# EasyEDA Pro project 主板&9V稳压.epro, board 主板V2
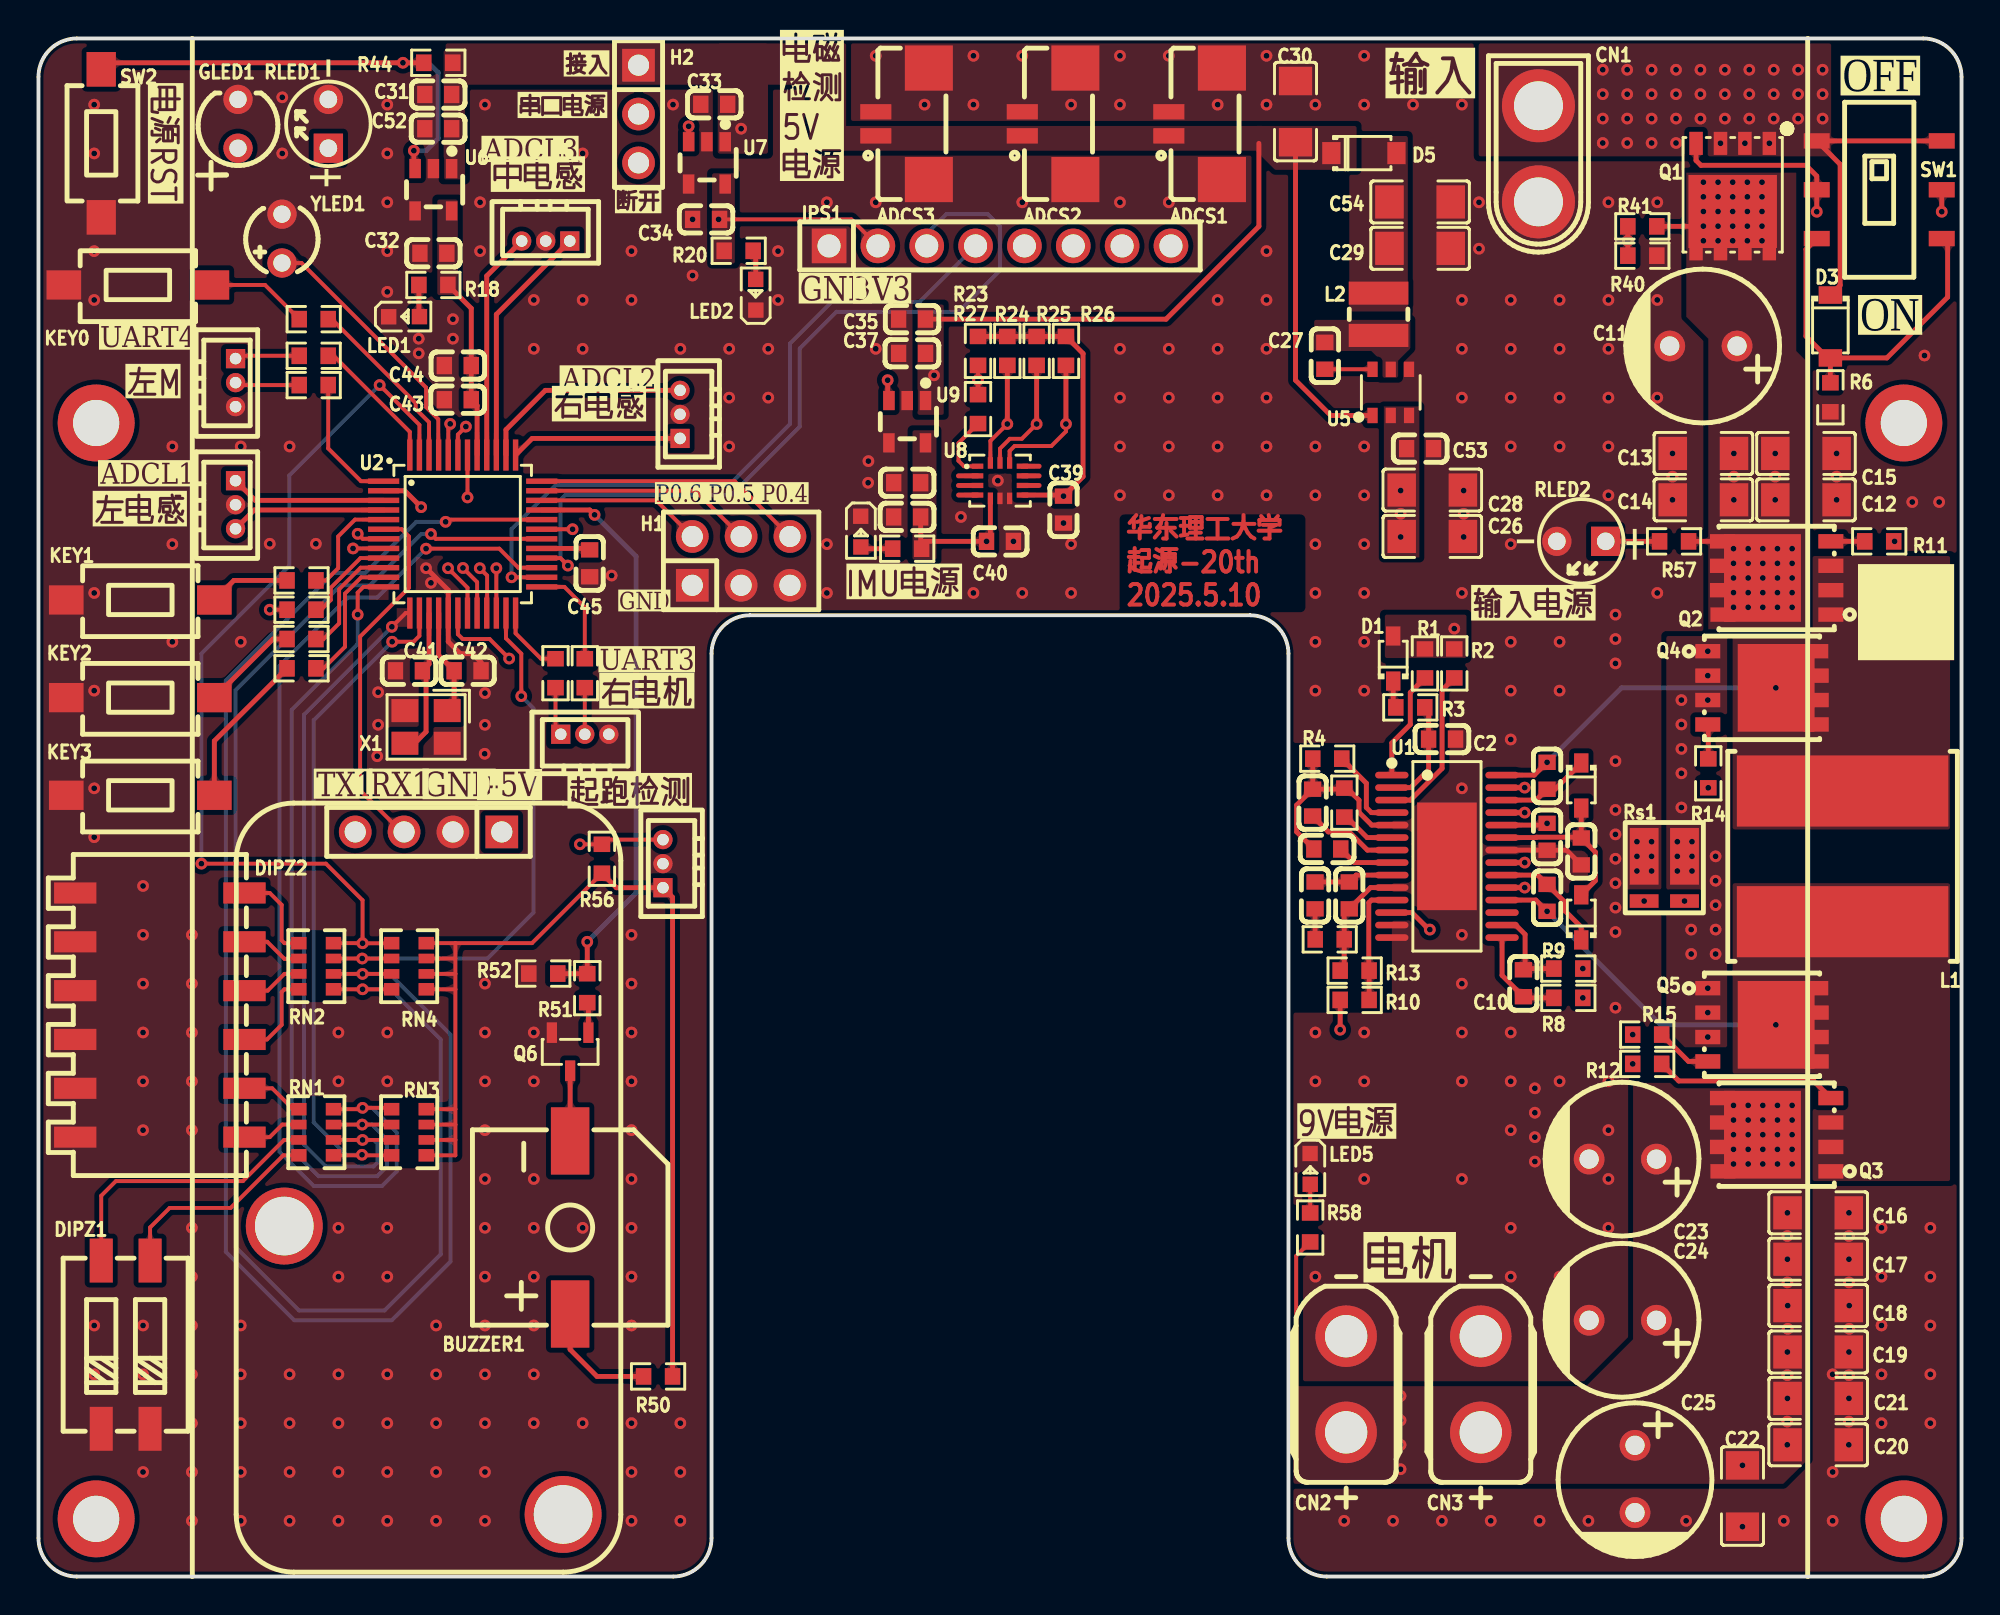
[diagram p6: board, top side]
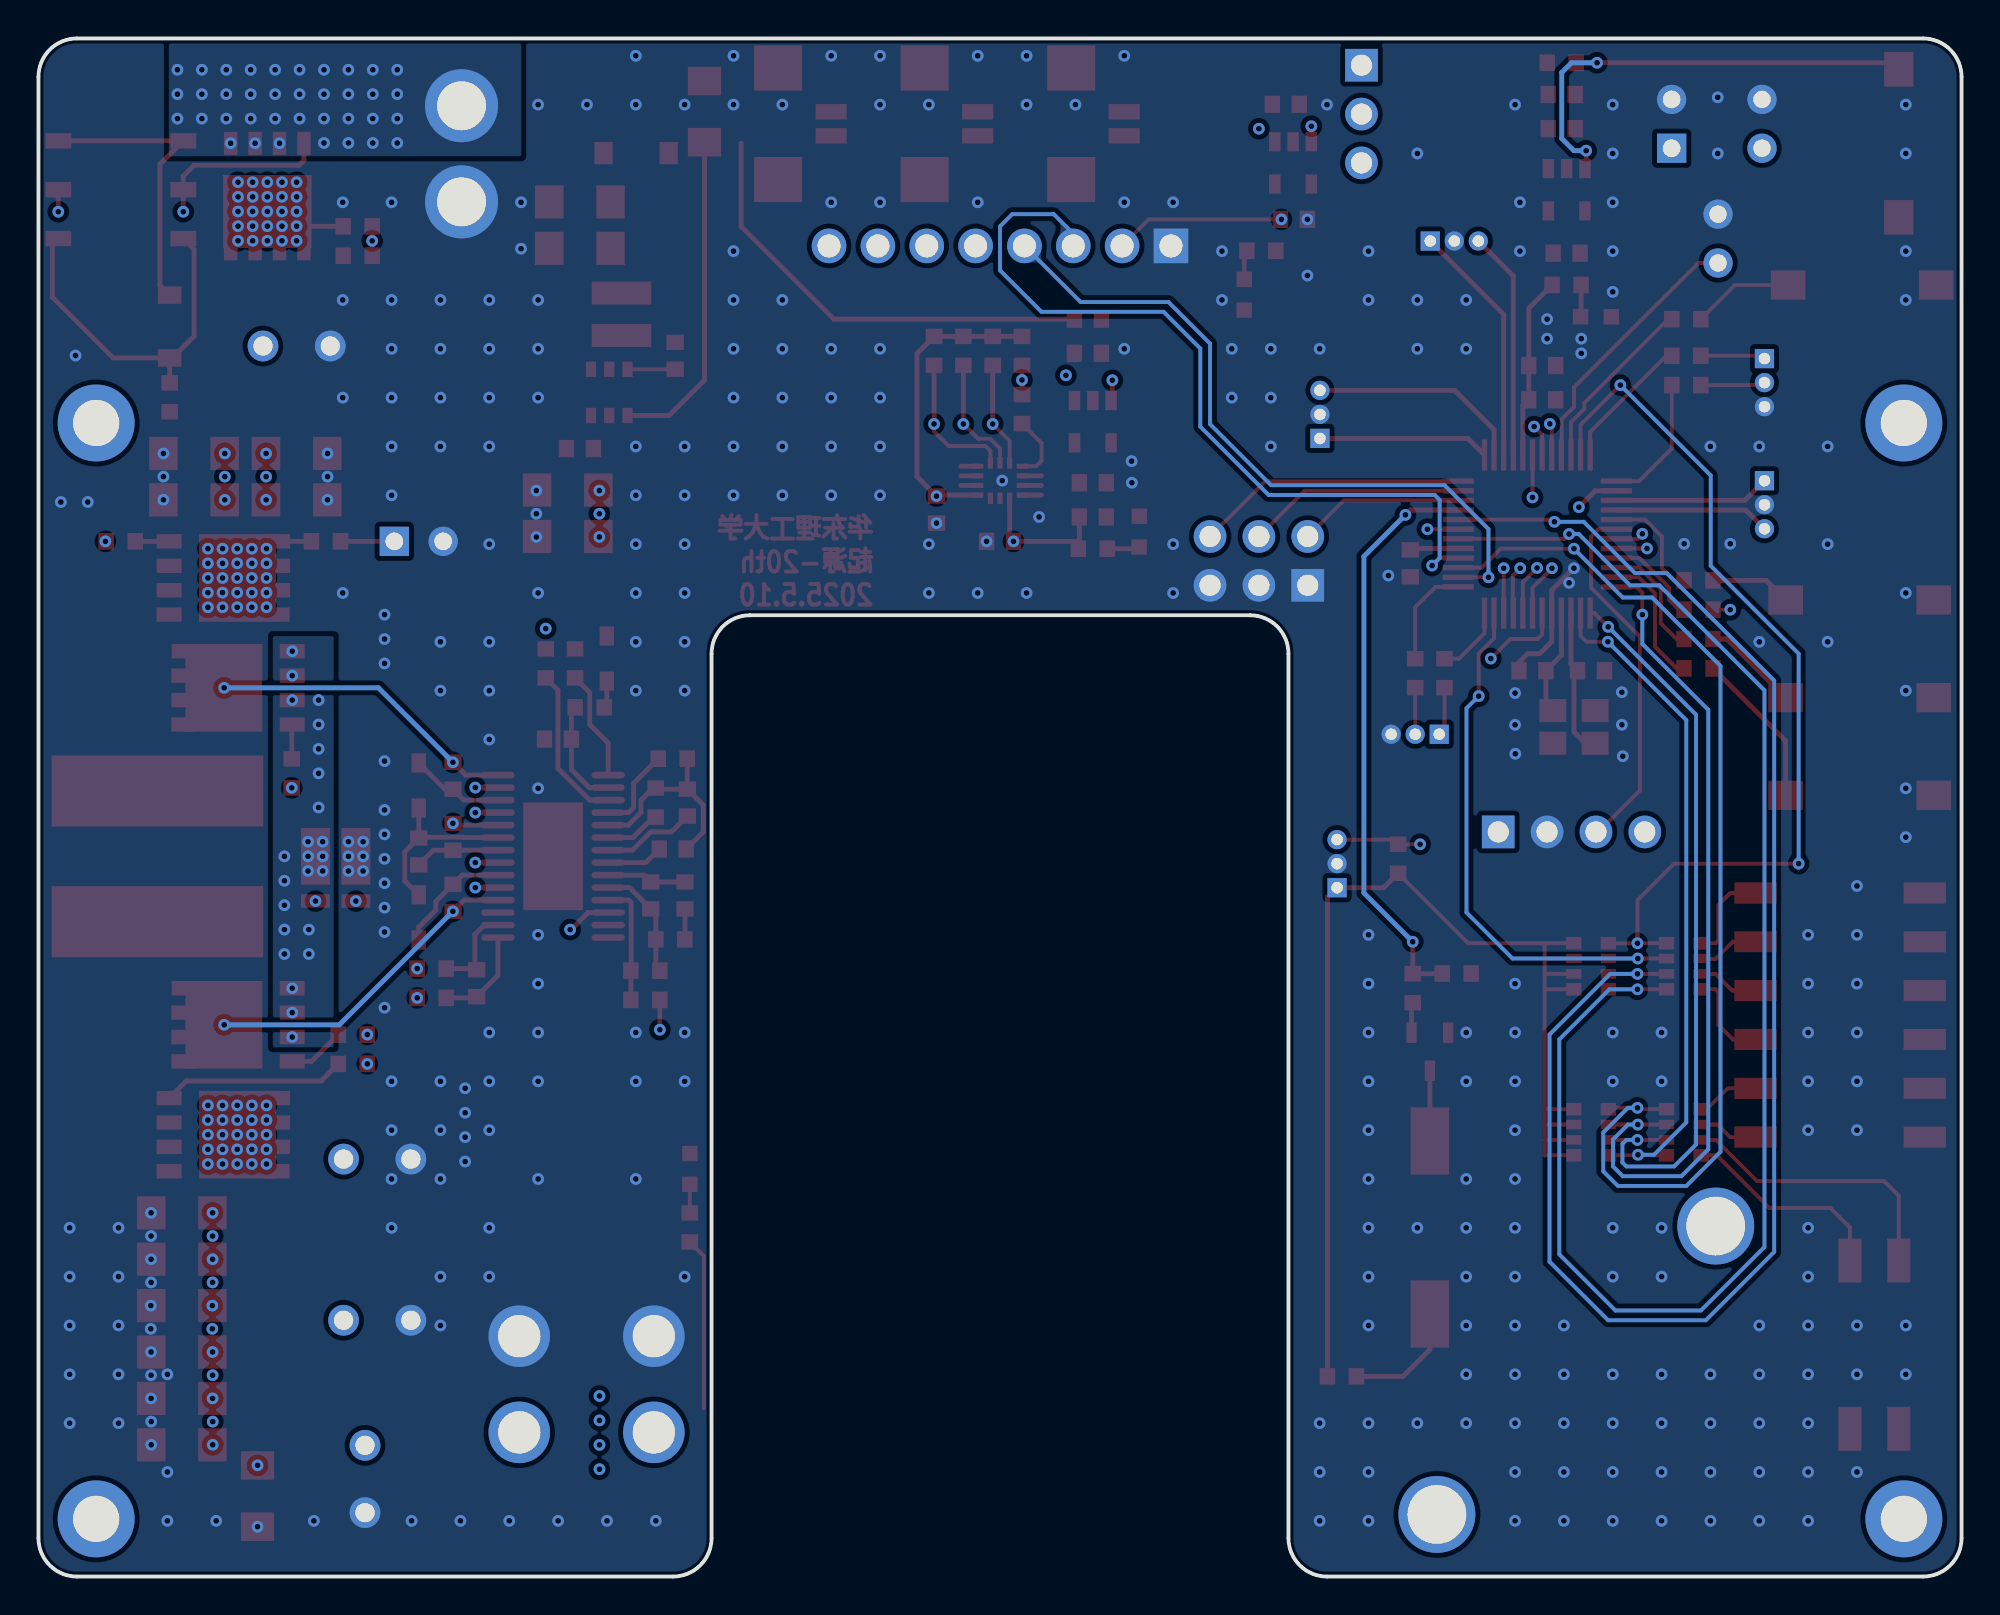
[diagram p7: board, bottom side, seen from below]

Outline 100 x 80 mm; copper layers: Top Layer, 主GND层, 辅助电源层, Bottom Layer. Coordinates in mm from the lower left corner of the outline.
Outline path: 0,78 0,2 arc(0.59,0.59) 2,0 33,0 arc(34.41,0.59) 35,2 35,48 arc(35.59,49.41) 37,50 63,50 arc(64.41,49.41) 65,48 65,2 arc(65.59,0.59) 67,0 98,0 arc(99.41,0.59) 100,2 100,78 arc(99.41,79.41) 98,80 2,80 arc(0.59,79.41) 0,78
Stack: Top Layer 0.035mm 外层铜厚1oz / Dielectric1 0.2104mm 7628 RC49% 8.6mil / 主GND层 0.0152mm 内层铜厚 / Dielectric2 1.065mm 1.1mm H/HOZ Copper / 辅助电源层 0.0152mm 内层铜厚 / Dielectric3 0.2104mm 7628 RC49% 8.6mil / Bottom Layer 0.035mm 外层铜厚1oz

## Design rules (mm)
template: xyf_v1.0
spacing copperThickness1oz (default): track to track 0.102, other pairs 0.152 to 0.3
spacing copperThickness2oz: track to track 0.203, other pairs 0.152 to 0.3
spacing copperThicknessInner0.5oz: track to track 0.089, other pairs 0.152 to 0.3
spacing 0焊盘板框间距: track to track 0.152, other pairs 0 to 0.3
track width copperThickness1oz (default): min 0.127, default 0.254, max 2.54
track width copperThickness2oz: min 0.203, default 0.254, max 2.54
track width copperThickness0.5oz: min 0.089, default 0.254, max 2.54
differential pair differentialPair (default): width min 0.127, default 0.254, max 2.54; gap min 0.152, default 0.152
via viaSize (default): diameter min 0.5, default 0.61, max 10; hole min 0.3, default 0.305, max 6.3
via viaSize2: diameter min 0.5, default 0.61, max 10; hole min 0.3, default 0.305, max 6.299
via viaSize4: diameter min 0.45, default 0.61, max 10; hole min 0.3, default 0.305, max 6.299

## Placement (name value [footprint] x y rotation side)
ADCL1  HC-1.25-3A  [CONN-TH_3P-P1.25_HCTL_HC-1.25-3A]  10.25 55.75 270 top
ADCL2  HC-1.25-3A  [CONN-TH_3P-P1.25_HCTL_HC-1.25-3A]  33.36 60.45 90 top
ADCL3  HC-1.25-3A  [CONN-TH_3P-P1.25_HCTL_HC-1.25-3A]  26.38 69.46 180 top
ADCS1  HC-1.25-2PLT  [CONN-SMD_HC-1.25-2PLT]  60.16 75.56 90 top
ADCS2  HC-1.25-2PLT  [CONN-SMD_HC-1.25-2PLT]  52.54 75.56 90 top
ADCS3  HC-1.25-2PLT  [CONN-SMD_HC-1.25-2PLT]  44.92 75.56 90 top
BUZZER1  3kHz  [BUZ-SMD_L9.6-W9.6-LS10.0-R]  27.65 18.16 270 top
C1  100nF  [C0603]  78.45 38.48 90 top
C2  100nF  [C0603]  72.99 43.56 0 top
C3  100nF  [C0603]  78.45 41.65 90 top
C4  1uF  [C0603]  80.23 37.71 270 top
C5  220pF  [C0603]  66.26 40.25 270 top
C6  15nF  [C0603]  67.02 37.84 0 top
C7  56nF  [C0603]  66.38 35.43 270 top
C8  1.5nF  [C0603]  68.16 35.43 90 top
C9  100nF  [C0603]  78.45 35.3 270 top
C10  47pF  [C0603]  77.22 30.86 90 top
C11  680uF  [CAP-TH_BD8.0-P3.50-D0.6-FD]  86.58 64 180 top
C12  10uF  [C1206]  91.91 56 180 top
C13  10uF  [C1206]  86.58 58.42 0 top
C14  10uF  [C1206]  86.58 56 0 top
C15  10uF  [C1206]  91.91 58.42 180 top
C16  10uF  [C1206]  92.54 18.92 180 top
C17  10uF  [C1206]  92.54 16.5 180 top
C18  10uF  [C1206]  92.54 14.09 180 top
C19  10uF  [C1206]  92.54 11.68 180 top
C20  10uF  [C1206]  92.54 6.85 180 top
C21  10uF  [C1206]  92.54 9.27 180 top
C22  10uF  [C1206]  88.61 4.19 90 top
C23  680uF  [CAP-TH_BD8.0-P3.50-D0.6-FD]  82.38 21.71 180 top
C24  680uF  [CAP-TH_BD8.0-P3.50-D0.6-FD]  82.38 13.33 180 top
C25  680uF  [CAP-TH_BD8.0-P3.50-D0.6-FD]  83.02 5.07 270 top
C26  22uF  [C1206]  72.48 54.1 180 top
C27  100nF  [C0603]  66.89 63.5 270 top
C28  22uF  [C1206]  72.48 56.51 180 top
C29  22uF  [C1206]  71.84 69.08 180 top
C30  22uF  [C1206]  65.37 76.19 270 top
C31  22uF  [C0603]  20.79 77.08 0 top
C32  22uF  [C0603]  20.54 68.83 0 top
C33  22uF  [C0603]  35.14 76.58 0 top
C34  22uF  [C0603]  34.72 70.59 0 top
C35  22uF  [C0603]  45.43 65.4 0 top
C36  22uF  [C0603]  45.17 56.89 0 top
C37  100nF  [C0603]  45.43 63.62 0 top
C38  100nF  [C0603]  45.17 55.11 0 top
C39  100nF  [C0603]  53.3 55.49 90 top
C40  100nF  [C0603]  50 53.84 180 top
C41  15pF  [C0603]  19.27 47.11 0 top
C42  15pF  [C0603]  22.31 47.11 0 top
C43  100nF  [C0603]  21.81 61.21 0 top
C44  22uF  [C0603]  21.81 62.99 0 top
C45  100nF  [C0603]  28.66 52.7 90 top
C52  100nF  [C0603]  20.79 75.31 0 top
C53  100nF  [C0603]  71.84 58.67 180 top
C54  22uF  [C1206]  71.84 71.5 180 top
CN1  XT30U-M  [CONN-TH_XT30U-M]  78 74 270 top
CN2  XT30UPB-F30.G.Y  [CONN-TH_XT30UPB-F]  68 10 90 top
CN3  XT30UPB-F30.G.Y  [CONN-TH_XT30UPB-F]  75 10 90 top
D1  1N5819WS  [SOD-323_L1.8-W1.3-LS2.5-RD]  70.45 47.75 90 top
D2  1N5819WS  [SOD-323_L1.8-W1.3-LS2.5-RD]  80.23 41.14 270 top
D3  BZT52C12  [SOD-123_L2.7-W1.6-LS3.7-RD]  93.18 65.02 270 top
D4  1N5819WS  [SOD-323_L1.8-W1.3-LS2.5-RD]  80.23 34.28 90 top
D5  B5819W  [SOD-123_L2.8-W1.8-LS3.7-RD]  68.92 74.04 0 top
DIPZ1  DSPV02LSGET  [SW-SMD_DSPV02LSGET]  4.53 12.06 0 top
DIPZ2  DSPV-06-LS-GET  [SW-SMD_DSPV-06-LS-GET]  6.31 29.2 270 top
GLED1  TJ-L3FYTLDKMCGSFLC7K-A5  [LED-TH_BD3.8-P2.54-FD]  10.38 75.56 90 top
H1  PZ254V-12-6P  [HDR-TH_6P-P2.54-V-M-R2-C3-S2.54]  36.54 52.83 0 top
H2  PZ254V-11-03P  [HDR-TH_3P-P2.54-V-M]  31.2 76.07 270 top
IPS1  2.54-1*8P母环保  [HDR-TH_8P-P2.54-V-F-1]  50 69.21 0 top
KEY0  TS3625A  [KEY-SMD_L6.0-W3.5-LS8.4]  5.17 67.18 180 top
KEY1  TS3625A  [KEY-SMD_L6.0-W3.5-LS8.4]  5.3 50.8 180 top
KEY2  TS3625A  [KEY-SMD_L6.0-W3.5-LS8.4]  5.3 45.72 180 top
KEY3  TS3625A  [KEY-SMD_L6.0-W3.5-LS8.4]  5.3 40.64 180 top
L1  2.2uH  [IND-SMD_L11.9-W11.0]  93.81 37.46 270 top
L2  10uH  [IND-SMD_L3.0-W3.0_FTC303020D]  69.69 65.65 90 top
LED1  XL-1608SURC-06  [LED0603-RD_RED]  19.01 65.53 0 top
LED2  XL-1608SURC-06  [LED0603-RD_RED]  37.3 66.67 90 top
LED3  XL-1608SURC-06  [LED0603-RD_RED]  42.76 54.35 270 top
LED5  XL-1608SURC-06  [LED0603-RD_RED]  66.13 21.2 270 top
Q1  AGM30P100A  [PDFN-8_L5.8-W4.9-P1.27-LS6.1-BL-A]  88.1 71.75 180 top
Q2  BSC0702LS  [PG-TDSON-8_L5.0-W6.0-P1.27-BL-EP]  90.39 51.94 90 top
Q3  BSC0702LS  [PG-TDSON-8_L5.0-W6.0-P1.27-BL-EP]  90.39 22.98 90 top
Q4  BSC0702LS  [PG-TDSON-8_L5.0-W6.0-P1.27-BL-EP]  89.62 46.22 270 top
Q5  BSC0702LS  [PG-TDSON-8_L5.0-W6.0-P1.27-BL-EP]  89.62 28.7 270 top
Q6  S8050  [SOT-23-3_L2.9-W1.3-P1.90-LS2.3-BR]  27.65 27.3 90 top
QR1  -  [JLC-QRCODE-5x5]  97.12 50.16 0 top
R1  2kΩ  [R0603]  72.1 47.49 90 top
R2  2kΩ  [R0603]  73.62 47.49 90 top
R3  10Ω  [R0603]  71.34 45.21 180 top
R4  93.1kΩ  [R0603]  67.02 42.54 0 top
R5  20kΩ  [R0603]  67.91 40.25 270 top
R6  10kΩ  [R0603]  93.18 61.34 270 top
R7  5.23kΩ  [R0603]  67.15 33.14 180 top
R8  100Ω  [R0603]  79.55 30.1 180 top
R9  100Ω  [R0603]  79.55 31.62 180 top
R10  205kΩ  [R0603]  68.44 29.99 180 top
R11  1.5Ω  [R0603]  95.72 53.84 180 top
R12  1.5Ω  [R0603]  83.66 26.67 180 top
R13  20kΩ  [R0603]  68.44 31.52 0 top
R14  1.5Ω  [R0603]  86.83 41.78 90 top
R15  1.5Ω  [R0603]  83.66 28.19 180 top
R18  10kΩ  [R0603]  20.54 67.18 0 top
R20  10kΩ  [R0603]  36.41 68.96 180 top
R21  10kΩ  [R0603]  45.17 53.46 0 top
R23  10kΩ  [R0603]  48.86 63.75 90 top
R24  10kΩ  [R0603]  50.38 63.75 270 top
R25  10kΩ  [R0603]  51.91 63.75 270 top
R26  10kΩ  [R0603]  53.43 63.75 270 top
R27  100Ω  [R0603]  48.86 60.72 270 top
R28  100Ω  [R0603]  14.31 63.5 180 top
R31  100Ω  [R0603]  26.89 46.98 90 top
R32  100Ω  [R0603]  28.41 46.98 270 top
R33  100Ω  [R0603]  14.31 61.97 0 top
R40  10kΩ  [R0603]  83.4 68.7 180 top
R41  47kΩ  [R0603]  83.4 70.23 0 top
R44  10kΩ  [R0603]  20.79 78.73 180 top
R45  100Ω  [R0603]  13.68 51.81 180 top
R46  100Ω  [R0603]  14.31 65.4 180 top
R47  100Ω  [R0603]  13.68 48.76 180 top
R48  100Ω  [R0603]  13.68 47.24 180 top
R50  10Ω  [R0603]  32.22 10.41 0 top
R51  5.23kΩ  [R0603]  28.54 30.6 90 top
R52  1kΩ  [R0603]  26.25 31.36 180 top
R55  100Ω  [R0603]  13.68 50.29 180 top
R56  10kΩ  [R0603]  29.3 37.33 270 top
R57  10kΩ  [R0603]  85.05 53.84 180 top
R58  10kΩ  [R0603]  66.13 18.16 90 top
RLED1  TJ-L3FYTGHRMFCLFLC2R-A5  [LED-TH_BD3.9-P2.54-FD]  15.08 75.56 90 top
RLED2  TJ-L3FYTGHRMFCLFLC2R-A5  [LED-TH_BD3.9-P2.54-FD]  80.23 53.84 180 top
RN1  100Ω  [RES-ARRAY-SMD_0603-8P-L3.2-W1.6-BL]  14.44 23.11 270 top
RN2  100Ω  [RES-ARRAY-SMD_0603-8P-L3.2-W1.6-BL]  14.44 31.75 270 top
RN3  10kΩ  [RES-ARRAY-SMD_0603-8P-L3.2-W1.6-BL]  19.27 23.11 270 top
RN4  10kΩ  [RES-ARRAY-SMD_0603-8P-L3.2-W1.6-BL]  19.27 31.75 270 top
Rs1  2mΩ  [RES-SMD_4P-L3.0-W3.8_HOBB1216]  84.54 36.3 180 top
RUNNING1  HC-1.25-3A  [CONN-TH_3P-P1.25_HCTL_HC-1.25-3A]  32.47 37.08 90 top
SCREW1  -  [M2螺丝（2.35）]  97 60 270 top
SCREW2  -  [M2螺丝（2.35）]  97 3 270 top
SCREW3  -  [M2螺丝（2.35）]  3 60 270 top
SCREW4  -  [M2螺丝（2.35）]  3 3 270 top
SCREW5  -  [M2螺丝]  12.78 18.23 270 top
SCREW6  -  [M2螺丝]  27.28 3.23 270 top
SW1  SS-3235S-L3  [SW-SMD_SS-3235S-L3.00]  95.72 72.13 90 top
SW2  TS3625A  [KEY-SMD_L6.0-W3.5-LS8.4]  3.26 74.54 270 top
U1  LM5176PWPR  [HTSSOP-28_L9.7-W4.4-P0.65-LS6.4-BL-EP]  73.24 37.46 270 top
U2  AI8051U-34K64-QFP48  [LQFP-48_L7.0-W7.0-P0.50-LS9.0-BL_1]  22.06 54.22 270 top
U5  SCT2325TVBR  [TSOT-23-6_L2.9-W1.6-P0.95-LS2.8-BR]  70.32 61.59 270 top
U6  TPS7A2033PDBVR  [SOT-23-5_L2.9-W1.6-P0.95-LS2.8-BR]  20.54 72.13 90 top
U7  TPS7A2033PDBVR  [SOT-23-5_L2.9-W1.6-P0.95-LS2.8-BR]  34.76 73.53 90 top
U8  BMI270  [LGA-14_L3.0-W2.5-P0.50-BR]  50 57 180 top
U9  TPS7A2033PDBVR  [SOT-23-5_L2.9-W1.6-P0.95-LS2.8-BR]  45.17 60.07 90 top
UART1  PM254V-11-04-H85  [HDR-TH_4P-P2.54-V-F]  20.28 38.73 180 top
UART3  HC-1.25-3A  [CONN-TH_3P-P1.25_HCTL_HC-1.25-3A]  28.41 43.81 0 top
UART4  HC-1.25-3A  [CONN-TH_3P-P1.25_HCTL_HC-1.25-3A]  10.25 62.1 270 top
X1  40MHz  [CRYSTAL-SMD_4P-L3.2-W2.5-BL]  20.16 44.19 180 top
YLED1  XL-302UYD  [LED-TH_BD3.8-P2.54-FD_YELLOW]  12.66 69.59 90 top

## Footprints (pads in the part's own frame, mm; a bottom-side part is the same pattern mirrored in y, then rotated)
BUZ-SMD_L9.6-W9.6-LS10.0-R
  rect 3.5x2 smd: 1(4.5,0) 2(-4.5,0)
C0603
  rect 0.8x0.9 smd: 1(-0.7,0) 2(0.7,0)
C1206
  rect 1.485x1.728 smd: 1(-1.593,0) 2(1.593,0)
CAP-TH_BD8.0-P3.50-D0.6-FD
  round 1.6 hole 1: 1(-1.75,0) 2(1.75,0)
CONN-SMD_HC-1.25-2PLT
  rect 0.8x1.62 smd: 1(-0.625,1.38) 2(0.625,1.38)
  rect 2.35x2.5 smd: 3(2.9,-1.38) 4(-2.9,-1.38)
CONN-TH_3P-P1.25_HCTL_HC-1.25-3A
  rect 1x1 hole 0.6: 1(-1.25,0)
  round 1 hole 0.6: 2(0,0) 3(1.25,0)
CONN-TH_XT30U-M
  round 3.8 hole 2.54: 1(-2.5,0) 2(2.5,0)
CONN-TH_XT30UPB-F
  round 3.2 hole 2.2: 1(-2.5,0) 2(2.5,0)
CRYSTAL-SMD_4P-L3.2-W2.5-BL
  rect 1.4x1.2 smd: 1(-1.1,-0.85) 2(1.1,-0.85) 3(1.1,0.85) 4(-1.1,0.85)
HDR-TH_3P-P2.54-V-M
  rect 1.7x1.7 hole 1.1: 1(-2.54,0)
  round 1.7 hole 1.1: 2(0,0) 3(2.54,0)
HDR-TH_4P-P2.54-V-F
  rect 1.7x1.7 hole 1.1: 1(-3.81,0)
  round 1.7 hole 1.1: 2(-1.27,0) 3(1.27,0) 4(3.81,0)
HDR-TH_6P-P2.54-V-M-R2-C3-S2.54
  rect 1.7x1.7 hole 1.1: 1(-2.54,-1.27)
  round 1.7 hole 1.1: 2(-2.54,1.27) 3(0,-1.27) 4(0,1.27) 5(2.54,-1.27) 6(2.54,1.27)
HDR-TH_8P-P2.54-V-F-1
  rect 1.8x1.8 hole 1.2: 1(-8.89,0)
  round 1.8 hole 1.2: 2(-6.35,0) 3(-3.81,0) 4(-1.27,0) 5(1.27,0) 6(3.81,0) 7(6.35,0) 8(8.89,0)
HTSSOP-28_L9.7-W4.4-P0.65-LS6.4-BL-EP
  oval 0.343x1.732 smd: 1(-4.225,-2.866) 2(-3.575,-2.866) 3(-2.925,-2.866) 4(-2.275,-2.866) 5(-1.625,-2.866) 6(-0.975,-2.866) 7(-0.325,-2.866) 8(0.325,-2.866) 9(0.975,-2.866) 10(1.625,-2.866) 11(2.275,-2.866) 12(2.925,-2.866) 13(3.575,-2.866) 14(4.225,-2.866) 15(4.225,2.866) 16(3.575,2.866) 17(2.925,2.866) 18(2.275,2.866) 19(1.625,2.866) 20(0.975,2.866) 21(0.325,2.866) 22(-0.325,2.866) 23(-0.975,2.866) 24(-1.625,2.866) 25(-2.275,2.866) 26(-2.925,2.866) 27(-3.575,2.866) 28(-4.225,2.866)
  rect 5.6x3.1 smd: 29(0,0)
IND-SMD_L3.0-W3.0_FTC303020D
  rect 1.2x3.1 smd: 1(-1.1,0) 2(1.1,0)
IND-SMD_L11.9-W11.0
  rect 3.7x11 smd: 1(-3.4,0) 2(3.4,0)
KEY-SMD_L6.0-W3.5-LS8.4
  rect 1.8x1.524 smd: 1(-3.85,0) 2(3.85,0)
LED0603-RD_RED
  rect 0.8x0.8 smd: 1(-0.799,-0.004) 2(0.799,0.004)
LED-TH_BD3.8-P2.54-FD
  round 1.524 hole 0.9: 1(-1.27,0) 2(1.27,0)
LED-TH_BD3.8-P2.54-FD_YELLOW
  round 1.524 hole 0.9: 1(-1.27,0) 2(1.27,0)
LED-TH_BD3.9-P2.54-FD
  rect 1.524x1.524 hole 0.914: 1(-1.27,0)
  round 1.524 hole 0.914: 2(1.27,0)
LGA-14_L3.0-W2.5-P0.50-BR
  rect 0.6x0.27 smd: 1(1.17,-0.75) 2(1.17,-0.25) 3(1.17,0.25) 4(1.17,0.75) 8(-1.17,0.75) 9(-1.17,0.25) 10(-1.17,-0.25) 11(-1.17,-0.75)
  rect 0.27x0.6 smd: 5(0.5,0.92) 6(0,0.92) 7(-0.5,0.92) 12(-0.5,-0.92) 13(0,-0.92) 14(0.5,-0.92)
LQFP-48_L7.0-W7.0-P0.50-LS9.0-BL_1
  rect 0.28x1.62 smd: 1(-2.75,-4.11) 2(-2.25,-4.11) 3(-1.75,-4.11) 4(-1.25,-4.11) 5(-0.75,-4.11) 6(-0.25,-4.11) 7(0.25,-4.11) 8(0.75,-4.11) 9(1.25,-4.11) 10(1.75,-4.11) 11(2.25,-4.11) 12(2.75,-4.11) 25(2.75,4.11) 26(2.25,4.11) 27(1.75,4.11) 28(1.25,4.11) 29(0.75,4.11) 30(0.25,4.11) 31(-0.25,4.11) 32(-0.75,4.11) 33(-1.25,4.11) 34(-1.75,4.11) 35(-2.25,4.11) 36(-2.75,4.11)
  rect 1.62x0.28 smd: 13(4.11,-2.75) 14(4.11,-2.25) 15(4.11,-1.75) 16(4.11,-1.25) 17(4.11,-0.75) 18(4.11,-0.25) 19(4.11,0.25) 20(4.11,0.75) 21(4.11,1.25) 22(4.11,1.75) 23(4.11,2.25) 24(4.11,2.75) 37(-4.11,2.75) 38(-4.11,2.25) 39(-4.11,1.75) 40(-4.11,1.25) 41(-4.11,0.75) 42(-4.11,0.25) 43(-4.11,-0.25) 44(-4.11,-0.75) 45(-4.11,-1.25) 46(-4.11,-1.75) 47(-4.11,-2.25) 48(-4.11,-2.75)
M2螺丝
  round 4 hole 3.05x2.02: 1(0,0)
M2螺丝（2.35）
  round 4 hole 2.4x2.35: 1(0,0)
PDFN-8_L5.8-W4.9-P1.27-LS6.1-BL-A
  rect 0.7x1.2 smd: 1(-1.905,-2.792) 2(-0.635,-2.792) 3(0.635,-2.792) 4(1.905,-2.792)
  rect 0.7x1 smd: 5(1.905,2.792) 6(0.635,2.792) 7(-0.635,2.792) 8(-1.905,2.792)
  rect 4.6x3.8 smd: 9(0,0.75)
PG-TDSON-8_L5.0-W6.0-P1.27-BL-EP
  rect 0.75x1.3 smd: 1(-1.905,-2.82) 2(-0.635,-2.82) 3(0.635,-2.82) 4(1.905,-2.82) 5(1.905,2.82) 6(0.635,2.82) 7(-0.635,2.82) 8(-1.905,2.794)
  rect 4.56x4 smd: 8(0,0.737)
R0603
  rect 0.806x0.864 smd: 1(-0.753,0) 2(0.753,0)
RES-ARRAY-SMD_0603-8P-L3.2-W1.6-BL
  rect 0.65x0.8 smd: 1(-1.2,-0.9) 4(1.2,-0.9) 5(1.2,0.9) 8(-1.2,0.9)
  rect 0.5x0.8 smd: 2(-0.4,-0.9) 3(0.4,-0.9) 6(0.4,0.9) 7(-0.4,0.9)
RES-SMD_4P-L3.0-W3.8_HOBB1216
  rect 1.5x2.95 smd: 1(-1.05,-1.163) 2(1.05,-1.163)
  rect 1.5x0.7 smd: 3(-1.05,1.163) 4(1.05,1.163)
SOD-123_L2.7-W1.6-LS3.7-RD
  rect 0.91x1.22 smd: 1(-1.635,0) 2(1.635,0)
SOD-123_L2.8-W1.8-LS3.7-RD
  rect 0.95x1.15 smd: 1(-1.692,0) 2(1.692,0)
SOD-323_L1.8-W1.3-LS2.5-RD
  rect 1x0.75 smd: 1(-1.173,0) 2(1.173,0)
SOT-23-3_L2.9-W1.3-P1.90-LS2.3-BR
  rect 1.07x0.532 smd: 1(0.99,-0.95) 2(0.99,0.95) 3(-0.99,0)
SOT-23-5_L2.9-W1.6-P0.95-LS2.8-BR
  rect 1x0.6 smd: 1(1.1,-0.95) 2(1.1,0) 3(1.1,0.95) 4(-1.1,0.95) 5(-1.1,-0.95)
SW-SMD_DSPV02LSGET
  rect 1.2x2.286 smd: 1(1.27,4.375) 2(-1.27,4.375) 3(-1.27,-4.375) 4(1.27,-4.375)
SW-SMD_DSPV-06-LS-GET
  rect 1.1x2.2 smd: 1(-6.35,-4.4) 2(-3.81,-4.4) 3(-1.27,-4.4) 4(1.27,-4.4) 5(3.81,-4.4) 6(6.35,-4.4) 7(-6.35,4.4) 8(-3.81,4.4) 9(-1.27,4.4) 10(1.27,4.4) 11(3.81,4.4) 12(6.35,4.4)
SW-SMD_SS-3235S-L3.00
  rect 0.8x1.35 smd: 1(-2.54,3.25) 2(0,3.25) 3(2.54,3.25) 4(-2.54,-3.25) 5(0,-3.25) 6(2.54,-3.25)
TSOT-23-6_L2.9-W1.6-P0.95-LS2.8-BR
  rect 0.8x0.532 smd: 1(1.2,-0.95) 2(1.2,0) 3(1.2,0.95) 4(-1.2,0.95) 5(-1.2,0) 6(-1.2,-0.95)

## Nets
As in the schematic.

Pads without a net: H2 3; SCREW1 1; SCREW2 1; SCREW3 1; SCREW4 1; SCREW5 1; SCREW6 1; U1 17; U8 2 3 4 9 10 11

## Via types
v1: diameter 0.61, hole 0.305, Top Layer to Bottom Layer, 567 vias

## Routing (per net, layer and track width the routed paths; a pad name or vN(x,y) marks a point on that pad's centre or on a via; arc(x,y) is an arc through that point)
3V3: length 144.4
  Top Layer w0.203: 21.68,24.31 21.68,23.51 ; 21.68,24.31 21.68,30.55 ; 21.68,24.31 RN3.8 ; 21.68,23.51 21.68,22.71 ; 21.68,23.51 RN3.7 ; RN4.5 21.68,30.55 ; 21.68,30.55 21.68,31.34 ; IPS1.2 42.27,70.59 C34.2 ; 21.68,22.71 21.68,21.91 RN3.5 ; 21.68,22.71 RN3.6 ; 21.68,31.34 21.68,32.14 ; 21.68,31.34 RN4.6 ; 21.68,32.14 21.68,32.94 ; 21.68,32.14 20.17,32.14 ; 21.68,32.94 20.17,32.94 ; 21.68,32.94 25.66,32.94 R56.2
  Top Layer w0.254: R56.2 30.05,35.83 RUNNING1.1 32.97,35.33 R50.2
  辅助电源层 w0.203: RUNNING1.1 34.51,37.86 34.51,49.14 35.78,50.41 54.32,50.41 60.41,56.51 60.41,70.1 59.91,70.61 45.05,70.61 IPS1.2
  vias: v1(35.37,70.59)
+5V: length 48
  Top Layer w0.254: 63.46,74.54 63.46,70.23 58.64,65.4 C35.2 ; v1(44.16,62.22) 44.16,61.23 U9.3 ; U5.1 67.2,60.39 65.37,62.22 C30.2 ; U7.3 v1(33.81,75.43)
  辅助电源层 w0.254: v1(36.54,75.31) 36.41,75.43 v1(33.81,75.43) ; v1(44.16,62.22) 44.41,62.48 v1(46.57,62.48)
+9V: length 65
  Top Layer w0.203: R58.1 65.4,16.68 65.4,8.76
  Top Layer w0.254: U1.24 78.36,39.08 v1(78.45,39.18) ; v1(72.35,33.65) 72.31,33.65 71.42,34.53 U1.12 ; R10.2 v1(67.69,28.44)
  主GND层 w0.254: v1(67.69,28.44) 82.8,13.33 C24.1
  辅助电源层 w0.254: 75.62,30.39 75.62,36.79 78,39.18 v1(78.45,39.18) ; 75.62,30.39 v1(72.35,33.65) ; 75.62,30.39 84.13,21.87 C23.1
  vias: v1(70.83,56.48) v1(70.83,55.28) v1(70.83,54.07) v1(70.83,9.39) v1(70.83,8.12) v1(70.83,6.85) v1(70.83,5.58) v1(88.14,24.51) v1(88.14,23.74) v1(88.14,22.98) v1(88.14,22.22) v1(88.14,21.46) v1(88.61,5.79) v1(88.9,24.51) v1(88.9,23.74) v1(88.9,22.98) v1(88.9,22.22) v1(88.9,21.46) v1(89.67,24.51) v1(89.67,23.74) v1(89.67,22.98) v1(89.67,22.22) v1(89.67,21.46) v1(90.43,24.51) v1(90.43,23.74) v1(90.43,22.98) v1(90.43,22.22) v1(90.43,21.46) v1(90.94,18.92) v1(90.94,17.71) v1(90.94,16.5) v1(90.94,15.3) v1(90.94,11.68) v1(90.94,10.47) v1(90.94,9.27) v1(90.94,8.06) v1(90.94,6.85) v1(90.96,14.09) v1(90.96,12.89) v1(91.19,24.51) v1(91.19,23.74) v1(91.19,22.98) v1(91.19,22.22) v1(91.19,21.46)
GND: length 28.1
  Top Layer w0.254: U1.5 69.33,39.08 68.67,39.75 68.67,40.38 68.04,41.01 R5.1 67.85,40.95 C5.1 66.26,40.96 R4.1 ; C6.1 65.43,38.73 65.43,40.13 66.25,40.95 ; U1.22 78.44,37.78 C1.1 79.46,37.78 C4.2 ; C42.2 23.01,47.56 22.57,48 21.93,48 21.31,48.62 U2.17 21.31,51.3 20.17,52.45 v1(20.16,52.45) ; U1.10 69.27,35.83 C8.1 67.9,34.47 R7.1 67.9,31.73 R13.1
  vias: v1(2.9,76.56) v1(2.9,74.02) v1(2.9,68.94) v1(2.9,66.4) v1(2.9,51.16) v1(2.9,46.08) v1(2.9,41) v1(2.9,38.46) v1(2.9,13.06) v1(2.9,10.52) v1(5.44,35.92) v1(5.44,33.38) v1(5.44,30.84) v1(5.44,28.3) v1(5.44,25.76) v1(5.44,23.22) v1(5.44,13.06) v1(5.44,10.52) v1(5.44,5.44) v1(6.96,58.78) v1(6.96,53.7) v1(6.96,48.62) v1(7.98,33.38) v1(7.98,30.84) v1(7.98,28.3) v1(7.98,25.76) v1(7.98,23.22) v1(7.98,18.14) v1(7.98,15.6) v1(7.98,13.06) v1(7.98,10.52) v1(7.98,7.98) v1(7.98,5.44) v1(7.98,2.9) v1(10.52,58.78) v1(10.52,48.62) v1(10.52,13.06) v1(10.52,10.52) v1(10.52,7.98) v1(10.52,5.44) v1(10.52,2.9) v1(12.03,53.72) v1(12.68,76.94) v1(12.68,74.02) v1(13.06,58.78) v1(13.06,10.52) v1(13.06,7.98) v1(13.06,5.44) v1(13.06,2.9) v1(14.43,53.72) v1(15.6,28.3) v1(15.6,25.76) v1(15.6,18.14) v1(15.6,15.6) v1(15.6,10.52) v1(15.6,7.98) v1(15.6,5.44) v1(15.6,2.9) v1(17.61,42.67) v1(17.66,46) v1(17.66,44.31) v1(18.14,76.56) v1(18.14,74.02) v1(18.14,71.48) v1(18.14,68.94) v1(18.14,66.82) v1(18.14,28.3) v1(18.14,25.76) v1(18.14,18.14) v1(18.14,15.6) v1(18.14,10.52) v1(18.14,7.98) v1(18.14,5.44) v1(18.14,2.9) v1(19.77,64.38) v1(19.77,63.62) v1(20.41,51.68) v1(20.68,13.06) v1(20.68,10.52) v1(20.68,7.98) v1(20.68,5.44) v1(20.68,2.9) v1(21.55,65.4) v1(21.55,64.38) v1(22.96,71.48) v1(22.96,68.94) v1(23.22,76.56) v1(23.22,45.95) v1(23.22,44.3) v1(23.2,42.79) v1(23.22,30.84) v1(23.22,28.3) v1(23.22,25.76) v1(23.22,23.22) v1(23.22,20.68) v1(23.22,18.14) v1(23.22,15.6) v1(23.22,13.06) v1(23.22,10.52) v1(23.22,7.98) v1(23.22,5.44) v1(23.22,2.9) v1(25.76,66.4) v1(25.76,63.86) v1(25.76,28.3) v1(25.76,25.76) v1(25.76,20.68) v1(25.76,18.14) v1(25.76,15.6) v1(25.76,13.06) v1(25.76,10.52) v1(25.76,7.98) v1(28.3,74.02) v1(28.3,66.4) v1(28.3,63.86) v1(28.3,18.14) v1(28.3,7.98) v1(29.81,52.06) v1(30.84,68.94) v1(30.84,66.4) v1(30.84,33.38) v1(30.84,30.84) v1(30.84,28.3) v1(30.84,25.76) v1(30.84,23.22) v1(30.84,20.68) v1(30.84,18.14) v1(30.84,15.6) v1(30.84,13.06) v1(30.84,7.98) v1(30.84,5.44) v1(30.84,2.9) v1(33,76.56) v1(33.38,63.86) v1(33.38,7.98) v1(33.38,5.44) v1(33.38,2.9) v1(34.02,70.59) v1(34.01,67.67) v1(35.92,63.86) v1(35.92,61.32) v1(35.92,58.78) v1(37.95,63.86) v1(37.95,61.32) v1(38.46,68.94) v1(38.46,66.4) v1(41,71.48) v1(41,53.7) v1(41,51.16) v1(43.14,56.89) v1(43.16,58.02) v1(43.54,79.1) v1(43.54,71.48) v1(43.54,63.86) v1(46.08,76.56) v1(47.97,55.11) v1(48.62,79.1) v1(48.62,76.56) v1(48.62,51.16) v1(49.89,57) v1(50.7,53.84) v1(51.16,79.1) v1(51.16,71.48) v1(51.16,51.16) v1(53.3,54.79) v1(53.7,76.56) v1(53.7,53.7) v1(53.7,51.16) v1(56.24,79.1) v1(56.24,76.56) v1(56.24,71.48) v1(56.24,63.86) v1(56.24,61.32) v1(56.24,58.78) v1(56.24,56.24) v1(58.78,79.1) v1(58.78,71.48) v1(58.78,63.86) v1(58.78,61.32) v1(58.78,58.78) v1(58.78,56.24) v1(61.32,76.56) v1(61.32,66.4) v1(61.32,63.86) v1(61.32,61.32) v1(61.32,58.78) v1(61.32,56.24) v1(63.86,79.1) v1(63.86,76.56) v1(63.86,68.94) v1(63.86,66.4) v1(63.86,63.86) v1(63.86,61.32) v1(63.86,58.78) v1(63.86,56.24) v1(66.4,76.56) v1(66.4,58.78) v1(66.4,56.24) v1(66.4,53.7) v1(66.4,51.16) v1(66.4,48.62) v1(66.4,46.08) v1(66.4,28.3) v1(66.4,25.76) v1(66.4,15.6) v1(67.9,2.9) v1(68.94,79.1) v1(68.94,76.56) v1(68.94,58.78) v1(68.94,56.24) v1(68.94,53.7) v1(68.94,51.16) v1(68.94,48.62) v1(68.94,46.08) v1(68.94,28.3) v1(68.94,25.76) v1(68.94,20.68) v1(70.44,2.9) v1(71.48,76.56) v1(72.98,2.9) v1(74.02,76.56) v1(74.02,66.4) v1(74.02,63.86) v1(74.02,61.32) v1(74.02,51.16) v1(74.02,41) v1(74.02,33.38) v1(74.02,30.84) v1(74.02,28.3) v1(74.02,25.76) v1(74.02,20.68) v1(74.11,56.48) v1(74.11,55.28) v1(74.11,54.07) v1(74.91,71.48) v1(74.91,69.06) v1(75.52,2.9) v1(76.56,66.4) v1(76.56,63.86) v1(76.56,61.32) v1(76.56,58.78) v1(76.56,53.7) v1(76.56,48.62) v1(76.56,46.08) v1(76.56,43.54) v1(76.56,28.3) v1(76.56,25.76) v1(76.56,23.22) v1(76.56,18.14) v1(76.56,15.6) v1(77.81,25.39) v1(77.81,24.12) v1(77.81,22.86) v1(77.81,21.59) v1(78.06,2.9) v1(79.1,66.4) v1(79.1,63.86) v1(79.1,61.32) v1(79.1,58.78) v1(79.1,48.62) v1(79.1,46.08) v1(79.1,25.76) v1(79.1,23.22) v1(79.1,20.68) v1(79.1,15.6) v1(79.1,13.06) v1(80.6,2.9) v1(81.64,71.48) v1(81.64,66.4) v1(81.64,63.86) v1(81.64,61.32) v1(81.64,58.78) v1(81.64,56.24) v1(81.64,25.76) v1(81.64,23.22) v1(81.64,20.68) v1(81.64,18.14) v1(82,50.03) v1(82,48.76) v1(82,47.49) v1(82,42.41) v1(82,39.87) v1(82,38.6) v1(82,37.33) v1(82,36.06) v1(82,34.79) v1(82,33.52) v1(82,29.59) v1(83.12,38.22) v1(83.12,37.46) v1(83.12,36.7) v1(83.88,38.22) v1(83.88,37.46) v1(83.88,36.7) v1(84.18,71.48) v1(84.18,66.4) v1(84.18,61.32) v1(84.18,51.16) v1(84.97,58.42) v1(84.97,57.21) v1(84.97,56) v1(85.68,2.9) v1(88.61,2.59) v1(90.76,2.9) v1(93.3,10.52) v1(93.3,5.44) v1(93.3,2.9) v1(93.5,58.42) v1(93.5,57.21) v1(93.5,56) v1(94.15,18.92) v1(94.15,17.71) v1(94.15,16.5) v1(94.15,15.3) v1(94.15,11.68) v1(94.15,10.47) v1(94.15,9.27) v1(94.14,8.06) v1(94.14,6.85) v1(94.16,14.09) v1(94.16,12.89) v1(95.84,18.14) v1(95.84,15.6) v1(95.84,13.06) v1(95.84,10.52) v1(95.84,7.98) v1(97.44,55.89) v1(98.07,63.51) v1(98.38,18.14) v1(98.38,15.6) v1(98.38,13.06) v1(98.38,10.52) v1(98.38,7.98) v1(98.84,55.89)
VCC: length 9.3
  Top Layer w0.254: 76.11,38.44 77.86,38.44 77.88,38.45 80.19,38.45 C4.1 ; C4.1 80.96,37.69 80.96,36.19 D4.2 ; C4.1 D2.2
VIN: length 23.2
  Top Layer w0.254: R41.2 87.33,70.23 v1(88.1,71) ; R57.1 Q2.5
  辅助电源层 w0.254: v1(73.62,49.3) 78.74,49.3 81.37,51.94 v1(88.14,51.94) v1(88.9,51.94) v1(89.67,51.94)
  vias: v1(86.58,72.52) v1(86.58,71.76) v1(86.58,71) v1(86.58,70.24) v1(86.58,69.48) v1(87.34,72.52) v1(87.34,71.76) v1(87.34,71) v1(87.34,70.24) v1(87.34,69.48) v1(88.1,72.52) v1(88.1,71.76) v1(88.1,70.24) v1(88.1,69.48) v1(88.14,53.46) v1(88.14,52.7) v1(88.14,51.18) v1(88.14,50.41) v1(88.16,58.42) v1(88.16,57.21) v1(88.16,56) v1(88.86,72.52) v1(88.86,71.76) v1(88.86,71) v1(88.86,70.24) v1(88.86,69.48) v1(88.9,53.46) v1(88.9,52.7) v1(88.9,51.18) v1(88.9,50.41) v1(89.62,72.52) v1(89.62,71.76) v1(89.62,71) v1(89.62,70.24) v1(89.62,69.48) v1(89.67,53.46) v1(89.67,52.7) v1(89.67,51.18) v1(89.67,50.41) v1(90.31,58.42) v1(90.31,57.21) v1(90.31,56) v1(90.43,53.46) v1(90.43,52.7) v1(90.43,51.94) v1(90.43,51.18) v1(90.43,50.41) v1(91.19,53.46) v1(91.19,52.7) v1(91.19,51.94) v1(91.19,51.18) v1(91.19,50.41)
(no net): length 5.5
  Top Layer w0.254: U8.11 52.03,57.75 ; U8.2 47.84,57.25 ; U8.3 47.84,56.75 ; U8.9 52.03,56.75 ; U8.4 47.85,56.25 ; U8.10 52.03,57.25
ADC_L1: length 8.1
  Top Layer w0.254: ADCL1.3 11.22,55.47 U2.4
ADC_L2: length 8.1
  Top Layer w0.254: ADCL1.1 11.27,55.97 U2.3
ADC_M1: length 11.9
  Top Layer w0.254: ADCL3.3 23.31,67.65 U2.40
ADC_M2: length 12.7
  Top Layer w0.254: ADCL3.1 23.81,65.65 U2.39
ADC_R1: length 11.2
  Top Layer w0.254: ADCL2.3 26.36,61.7 24.31,59.65 U2.38
ADC_R2: length 8.9
  Top Layer w0.254: ADCL2.1 25.67,59.2 U2.37
ADC_VIN: length 77.5
  Top Layer w0.254: v1(19.9,55.62) 19.05,56.47 U2.2 ; R40.2 v1(82.65,69.47) R41.1
  辅助电源层 w0.254: v1(19.9,55.62) 21.04,56.76 24.09,56.76 41.36,74.04 80.48,74.04 82.65,71.87 v1(82.65,69.47)
BEEP: length 30.2
  Top Layer w0.254: v1(28.92,55.22) 28.66,55.47 U2.33 ; R52.1 27.01,31.36 R51.2 v1(28.54,33.02)
  Bottom Layer w0.254: v1(28.54,33.02) 31.08,35.56 31.08,53.06 v1(28.92,55.22)
CSG: length 6.8
  主GND层 w0.254: v1(83.49,35.14) 83.49,32.6 80.99,30.1 v1(80.31,30.1)
DIP1: length 39.3
  Top Layer w0.203: RN1.6 v1(16.85,22.71) RN3.3 ; U2.13 19.09,50.11 v1(18.38,49.4)
  Bottom Layer w0.203: v1(16.85,22.71) 17.43,22.71 17.63,22.51 17.63,21.53 17.43,21.33 14.95,21.33 13.81,22.47 13.81,44.83 v1(18.38,49.4)
DIP2: length 35.7
  Top Layer w0.203: RN1.5 16.8,21.91 v1(16.82,21.94) 16.85,21.91 RN3.4 ; U2.14 19.81,48.93 19.51,48.62 v1(18.39,48.62)
  Bottom Layer w0.203: v1(16.82,21.94) 15.99,21.94 14.31,23.62 14.31,44.54 v1(18.39,48.62)
DIP3: length 47.7
  Top Layer w0.203: v1(16.85,32.94) 16.85,32.94 15.34,32.94 ; v1(16.85,32.94) 16.85,35.17 14.95,37.08 v1(8.47,37.08) ; v1(16.85,32.94) 18.36,32.94 18.37,32.94 ; v1(17.74,61.97) 19.81,59.9 U2.47
  Bottom Layer w0.203: v1(8.47,37.08) 8.47,48 13.04,52.57 13.04,57.27 v1(17.74,61.97)
DIP4: length 29.1
  Top Layer w0.203: 18.37,32.14 16.83,32.14 ; RN2.7 v1(16.83,32.15) ; U2.23 24.31,48.8 25.11,48 v1(25.11,45.79)
  Bottom Layer w0.203: v1(25.11,45.79) 25.74,45.16 25.74,34.54 23.35,32.15 v1(16.83,32.15)
DIP5: length 84.7
  Top Layer w0.203: RN4.3 16.85,31.34 ; 15.34,31.35 v1(16.85,31.35) ; U2.32 21.29,54.97 v1(21.17,54.86)
  Bottom Layer w0.203: v1(16.85,31.35) 18.27,31.35 21.42,28.19 21.42,16.38 18.38,13.33 13.3,13.33 9.74,16.89 9.74,46.6 15.33,52.19 16.98,52.19 19.65,54.86 v1(21.17,54.86)
DIP6: length 80.9
  Top Layer w0.203: RN4.4 v1(16.85,30.55) RN2.5 ; U2.30 20.66,53.97 v1(20.41,54.22)
  Bottom Layer w0.203: v1(16.85,30.55) 18.31,30.55 20.92,27.94 20.92,16.76 18,13.84 13.55,13.84 10.25,17.14 10.25,46.1 15.71,51.56 17.23,51.56 19.9,54.22 v1(20.41,54.22)
DIP7: length 56.4
  Top Layer w0.203: RN1.8 16.78,24.31 v1(16.85,24.38) 18.3,24.38 RN3.1 ; v1(20.16,53.46) 23.97,53.46 24.95,52.47 U2.27
  Bottom Layer w0.203: v1(20.16,53.46) 17.61,50.92 16.09,50.92 12.53,47.37 12.53,22.09 14.31,20.31 17.87,20.31 18.63,21.08 18.63,23.1 17.35,24.38 v1(16.85,24.38)
DIP8: length 43.6
  Top Layer w0.203: v1(16.6,50.03) 16.6,51.18 16.9,51.47 U2.12 ; RN1.7 v1(16.83,23.51) RN3.2
  Bottom Layer w0.203: v1(16.83,23.51) 17.34,23.51 18.12,22.73 18.12,21.33 17.61,20.82 14.57,20.82 13.17,22.22 13.17,45.08 16.6,48.51 v1(16.6,50.03)
FB: length 6.3
  Top Layer w0.254: U1.11 69.31,35.19 69.18,35.05 69.18,31.53 R13.2 R10.1
HDRV1: length 27.9
  Top Layer w0.254: U1.27 v1(77.29,41.03)
  辅助电源层 w0.254: v1(77.29,41.03) 78.47,41.03 86.32,48.89 94.96,48.89 96.77,50.71 96.77,53.59 v1(96.52,53.84)
HDRV2: length 14.5
  Top Layer w0.254: U1.19 v1(77.29,35.83)
  辅助电源层 w0.254: v1(77.29,35.83) 78.42,35.83 79.21,35.05 79.21,28.44 80.99,26.67 v1(82.9,26.67)
IMU_3V3: length 27.8
  Top Layer w0.254: U8.5 49.5,54.04 v1(49.3,53.84) 45.87,53.84 C38.2 ; R23.2 R24.1 R25.1 R26.1 54.32,63.61 54.32,57.21 v1(53.3,56.19) 53.25,56.25 U8.8
  主GND层 w0.254: v1(49.3,53.84) 51.65,56.19 v1(53.3,56.19)
IMU_CS: length 45.9
  Top Layer w0.203: U2.18 21.81,49.01 22.06,48.76 23.46,48.76 v1(24.48,47.75) ; U8.12 50.5,58.54 50.76,58.8 52.67,58.8 53.43,59.56 v1(53.43,59.95)
  Top Layer w0.254: R26.2 v1(53.43,59.95)
  主GND层 w0.203: v1(53.43,59.95) 53.43,59.56 46.7,52.83 33.21,52.83 28.13,47.75 v1(24.48,47.75)
IMU_SDI: length 31.9
  Top Layer w0.203: U8.14 49.5,59.07 v1(50.38,59.95) ; U2.31 v1(27.78,54.47)
  Top Layer w0.254: R24.2 v1(50.38,59.95)
  辅助电源层 w0.203: v1(50.38,59.95) 46.05,55.62 30.31,55.62 29.17,54.47 v1(27.78,54.47)
IMU_SDO: length 33.3
  Top Layer w0.203: R23.1 v1(48.86,62.24) ; U2.42 v1(22.31,56.13)
  Top Layer w0.254: R27.1 v1(48.86,62.24)
  辅助电源层 w0.203: v1(22.31,56.13) 43.52,56.13 48.86,61.46 v1(48.86,62.24)
IMU_SPC: length 50.8
  Top Layer w0.203: U2.7 16.86,53.97 v1(16.6,54.24) ; v1(51.91,59.95) 51.13,59.18 50.51,59.18 50,58.67 U8.13
  Top Layer w0.254: R25.2 v1(51.91,59.95)
  辅助电源层 w0.203: v1(51.91,59.95) 51.91,58.03 46.82,52.95 32.47,52.95 28.54,49.02 21.94,49.02 16.73,54.24 v1(16.6,54.24)
IPS_BLK: length 47.9
  Top Layer w0.203: U2.22 v1(23.81,52.45)
  主GND层 w0.203: v1(23.81,52.45) 27.57,56.2 39.66,56.2 42.61,59.15 42.61,65.25 43.78,66.42 56.1,66.42 IPS1.8
IPS_CS: length 46.5
  Top Layer w0.203: v1(22.95,52.45) 23.33,52.06 23.33,50.13 U2.21
  主GND层 w0.203: IPS1.7 54.06,66.92 43.52,66.92 42.13,65.53 42.13,59.3 39.46,56.64 27.14,56.64 v1(22.95,52.45)
IPS_DC: length 45
  Top Layer w0.203: U2.20 22.81,51.72 v1(22.07,52.46)
  主GND层 w0.203: v1(22.07,52.46) 26.76,57.14 39.33,57.14 41.62,59.43 41.62,65.78 43.27,67.43 52.03,67.43 IPS1.6
IPS_RST: length 43.6
  Top Layer w0.203: v1(21.3,52.45) 22.31,51.43 U2.19
  主GND层 w0.203: v1(21.3,52.45) 21.3,52.7 26.25,57.65 39.21,57.65 41.11,59.56 41.11,66.03 43.01,67.94 50,67.94 IPS1.5
IPS_SCL: length 42.7
  Top Layer w0.203: U2.28 27.14,52.97 v1(27.53,52.58)
  Bottom Layer w0.203: IPS1.3 46.19,69.84 47.21,70.86 49.37,70.86 50,70.23 50,67.94 47.84,65.78 41.49,65.78 39.59,63.88 39.59,59.81 36.03,56.26 27.39,56.26 27.14,56 27.14,52.97 v1(27.53,52.58)
IPS_SDA: length 36.8
  Top Layer w0.203: U2.26 v1(24.6,51.97)
  Bottom Layer w0.203: v1(24.6,51.97) 24.6,54.48 26.89,56.76 35.9,56.76 39.08,59.94 39.08,64.13 41.24,66.29 45.81,66.29 IPS1.4
K_NRST: length 5.8
  Top Layer w0.203: U2.5 16.46,54.97 15.58,54.1 15.58,52.45 14.95,51.81 R45.1
KEY0: length 9.3
  Top Layer w0.203: U2.46 20.31,60.04 19.61,60.73 19.61,61.04 15.25,65.4 R46.1
KEY2: length 6.1
  Top Layer w0.203: U2.10 16.75,52.47 15.63,51.35 15.63,49.58 14.82,48.76 R47.1
KEY3: length 7.1
  Top Layer w0.203: R48.1 14.82,47.24 15.94,48.36 15.94,51.13 16.79,51.97 U2.11
LDRV1: length 11.3
  Top Layer w0.254: U1.25 v1(77.29,39.73)
  辅助电源层 w0.254: v1(77.29,39.73) 77.93,39.73 79.22,41.02 v1(86.83,41.02)
LDRV2: length 14.5
  Top Layer w0.254: 76.11,37.14 v1(77.29,37.14)
  辅助电源层 w0.254: v1(82.9,28.19) 80.48,28.19 79.72,28.95 79.72,35.81 78.39,37.14 v1(77.29,37.14)
LED_G: length 24.9
  Top Layer w0.203: v1(22.23,59.81) 21.81,59.4 U2.43
  辅助电源层 w0.203: v1(22.23,59.81) 21.46,59.05 17.49,59.05 10.38,66.16 GLED1.1
LED_R: length 20.8
  Top Layer w0.203: U2.44 21.31,59.85 v1(21.41,59.95)
  辅助电源层 w0.203: RLED1.1 15.08,62.61 17.73,59.95 v1(21.41,59.95)
LED_Y: length 14
  Top Layer w0.203: YLED1.1 13.68,68.32 20.16,61.84 20.16,60.83 20.79,60.19 20.79,58.35 U2.45
P0.4: length 14.1
  Top Layer w0.203: U2.36 36.2,56.97 H1.6
P0.5: length 11.4
  Top Layer w0.203: U2.35 34.16,56.47 H1.4
P0.6: length 8.6
  Top Layer w0.203: U2.34 32.12,55.97 H1.2
RCS: length 8.4
  主GND层 w0.254: v1(85.59,35.14) 85.01,35.72 83.25,35.72 82.91,35.38 82.91,33.41 81.12,31.62 v1(80.31,31.62)
RUNNING: length 5
  Top Layer w0.203: R55.1 14.69,50.29 15.2,50.8 15.2,51.43 16.75,52.97 U2.9
RX1: length 18.9
  Top Layer w0.203: UART1.3 18.89,38.73 16.73,40.89 16.73,48.89 19.27,51.43 19.27,54.1 18.89,54.47 U2.6
RX3: length 2.5
  Top Layer w0.203: R31.1 26.89,44.08 UART3.1
RX4: length 3.4
  Top Layer w0.203: UART4.1 10.4,63.5 R28.2
STC_3V3: length 9.5
  Top Layer w0.254: U2.41 22.81,60.91 C43.2 C44.2 22.51,65.96 R18.2
SW1: length 16.1
  Top Layer w0.254: U1.28 77.78,41.69 v1(78.45,42.35)
  Bottom Layer w0.254: v1(78.45,42.35) 82.32,46.22 v1(90.34,46.22)
SW2: length 16.9
  Top Layer w0.254: v1(78.45,34.6) 77.86,35.19 U1.18
  Bottom Layer w0.254: v1(90.34,28.7) 84.35,28.7 v1(78.45,34.6)
TX1: length 16.9
  Top Layer w0.203: U2.8 v1(16.36,53.47)
  辅助电源层 w0.203: v1(16.36,53.47) 15.96,53.08 15.96,38.87 16.11,38.73 UART1.4
TX3: length 2.4
  Top Layer w0.203: R32.2 UART3.2
TX4: length 3.4
  Top Layer w0.203: R33.1 10.38,61.97 UART4.2
VCAP: length 15.2
  Top Layer w0.254: SW1.6 SW1.3 93.69,73.45 93.69,67.16 D3.1
  vias: v1(81.34,78.37) v1(81.34,77.1) v1(81.34,75.83) v1(81.34,74.56) v1(82.61,78.37) v1(82.61,77.1) v1(82.61,75.83) v1(82.61,74.56) v1(83.88,78.37) v1(83.88,77.1) v1(83.88,75.83) v1(83.88,74.56) v1(85.15,78.37) v1(85.15,77.1) v1(85.15,75.83) v1(85.15,74.56) v1(86.42,78.37) v1(86.42,77.1) v1(86.42,75.83) v1(87.47,74.55) v1(87.69,78.37) v1(87.69,77.1) v1(87.69,75.83) v1(88.74,74.55) v1(88.96,78.37) v1(88.96,77.1) v1(88.96,75.83) v1(90,74.55) v1(90.23,78.37) v1(90.23,77.1) v1(90.23,75.83) v1(91.5,78.37) v1(91.5,77.1) v1(91.5,75.83) v1(92.77,78.37) v1(92.77,77.1) v1(92.77,75.83)
$1N903: length 5.6
  Top Layer w0.254: U1.2 71.35,41.03 72.29,41.97 C2.1 72.29,45.01 R3.1
$1N1101: length 8.3
  Top Layer w0.254: R2.1 72.99,46.1 72.99,42.03 71.34,40.39 U1.3
$1N1220: length 4.5
  Top Layer w0.254: U1.4 69.31,39.73 69.05,40 69.05,41.26 R4.2
$1N1330: length 2.9
  Top Layer w0.254: 70.38,38.44 69.09,38.44 68.03,39.5 R5.2
$1N1402: length 4.9
  Top Layer w0.254: C5.2 67.08,38.73 68.16,38.73 69.11,37.78 U1.7
$1N1711: length 2.9
  Top Layer w0.254: C6.2 68.42,37.14 70.38,37.14
$1N1716: length 4.1
  Top Layer w0.254: U1.9 68.52,36.48 C8.2 C7.1
$1N2046: length 5.1
  Top Layer w0.254: R8.2 77.28,30.1 77.22,30.16 76.11,31.27 U1.15
$1N2059: length 4.8
  Top Layer w0.254: U1.16 76.82,33.89 77.31,33.4 77.31,31.65 77.28,31.62 ; 77.28,31.62 C10.2 ; 77.28,31.62 R9.2
$1N2215: length 4.9
  Top Layer w0.254: U1.26 77.88,40.39 C3.1 78.86,40.95 D2.1
$1N23253: length 1.4
  Top Layer w0.254: R3.2 70.45,45.34 D1.1
$1N28303: length 5.8
  Top Layer w0.254: R1.1 71.34,45.98 71.34,44.32 70.38,43.36 U1.1
$1N30337:
  vias: v1(85.22,38.22) v1(85.22,37.46) v1(85.22,36.7) v1(85.43,45.59) v1(85.43,44.32) v1(85.43,43.05) v1(85.43,41.78) v1(85.43,40) v1(85.94,33.65) v1(85.94,32.38) v1(85.98,38.22) v1(85.98,37.46) v1(85.98,36.7) v1(86.8,48.13) v1(86.8,46.86) v1(86.8,45.59) v1(86.8,30.6) v1(86.8,29.33) v1(86.8,28.06) v1(87.21,37.46) v1(87.21,36.19) v1(87.21,34.92) v1(87.21,33.65) v1(87.21,32.38)
$1N30672: length 9.5
  Top Layer w0.254: Q3.4 92.32,25.78 85.3,25.78 R12.1
$1N30676: length 1.8
  Top Layer w0.254: R11.2 Q2.4
$1N30680: length 1.8
  Top Layer w0.254: R14.2 86.83,44.29 Q4.4
$1N30684: length 3
  Top Layer w0.254: Q5.4 85.81,26.79 R15.1
$1N30960: length 6.2
  Top Layer w0.254: D4.1 80.23,33.78 79.34,34.67 79.34,35.11 C9.1 77.96,36.48 U1.20
$1N33364: length 18.9
  Top Layer w0.254: D3.2 R6.1 ; D3.2 93.04,63.38 91.91,64.51 91.91,69.03 SW1.1 ; D3.2 96.12,63.38 99.28,66.54 99.28,69.28 SW1.4
$1N33503: length 17
  Top Layer w0.254: SW1.5 v1(98.97,70.99) ; v1(92.47,70.99) SW1.2 92.47,72.84 91.91,73.4 86.45,73.4 86.19,73.66 Q1.4
  主GND层 w0.254: v1(98.97,70.99) v1(92.47,70.99)
$1N39218: length 1.6
  Top Layer w0.254: C7.2 66.38,33.15 R7.2
$1N43993: length 1.7
  Top Layer w0.254: R18.1 19.78,65.76 19.56,65.53
$1N44340: length 1.5
  Top Layer w0.254: R20.1 37.3,68.82 LED2.2
$1N44411: length 24.9
  Top Layer w0.254: R44.2 v1(18.95,78.73) 3.61,78.73 SW2.1 ; v1(19.52,74.16) 19.52,73.3 U6.3
  Bottom Layer w0.254: v1(18.95,78.73) 20.28,78.73 20.79,78.23 20.79,74.8 20.16,74.16 v1(19.52,74.16)
$1N46790: length 2.8
  Top Layer w0.254: RLED2.1 R57.2
$1N58470: length 1.5
  Top Layer w0.203: LED5.2 66.13,20.4 R58.2
$1N58732: length 2.5
  Top Layer w0.203: C27.2 69.37,62.8 U5.6
$3N718: length 1.7
  Top Layer w0.254: LED3.2 42.85,53.46 R21.1
$3N1301: length 3.5
  Top Layer w0.203: U8.1 48.12,57.75 47.84,58.03 47.84,58.95 R27.2
$3N1430: length 5.6
  Top Layer w0.254: U2.16 20.81,47.92 C42.1 21.61,45.4 X1.1
$3N1436: length 7.7
  Top Layer w0.254: 19.06,43.34 19.56,43.34 20.16,43.94 20.16,46.92 C41.2 20.31,47.46 U2.15
$3N2154: length 2.5
  Top Layer w0.254: U2.29 28.59,53.47 C45.2
$3N2428: length 3.7
  Top Layer w0.203: U2.24 24.81,49.06 26.13,47.74 R31.2
$3N2431: length 5.4
  Top Layer w0.203: U2.25 27.35,51.47 28.41,50.41 R32.1
$3N2686: length 7.1
  Top Layer w0.203: U2.48 19.31,59.54 15.35,63.5 R28.1
$3N2803: length 6.9
  Top Layer w0.203: R33.2 15.07,58.68 16.77,56.97 U2.1
$3N4387: length 4.2
  Top Layer w0.254: R45.2 10.16,51.81 KEY1.1
$3N4484: length 5.3
  Top Layer w0.203: R46.2 11.78,67.18 9.02,67.18
$3N4581: length 5
  Top Layer w0.254: R47.2 12.19,48.76 KEY2.1
$3N4678: length 8.2
  Top Layer w0.254: KEY3.1 9.15,43.46 R48.2
$3N5200: length 6.2
  Top Layer w0.254: BUZZER1.1 27.65,11.81 29.04,10.41 R50.1
$3N5220: length 3.7
  Top Layer w0.254: Q6.3 BUZZER1.2
$3N5339: length 1.6
  Top Layer w0.254: R51.1 28.6,29.79 Q6.1
$3N5727: length 39.4
  Top Layer w0.203: v1(28.16,38.09) R56.1 29.54,38.33 RUNNING1.3 ; R55.2 v1(12.03,50.29)
  辅助电源层 w0.203: v1(28.16,38.09) 25.73,40.51 23.2,40.51 22.69,40 22.69,37.21 21.3,35.81 13.93,35.81 12.03,37.71 v1(12.03,50.29)
$3N6338: length 87.3
  辅助电源层 w0.508: UART1.1 24.09,36.95 21.42,34.28 9.87,34.28 5.93,38.22 5.93,75.81 8.14,78.02 29.25,78.02 H2.2
$3N9278: length 11
  Top Layer w0.203: RN1.4 12.73,21.91 10,19.17 6.82,19.17 5.8,18.16 DIPZ1.1
$3N9287: length 14.9
  Top Layer w0.203: DIPZ1.2 3.26,19.81 4.03,20.57 10.63,20.57 12.77,22.71 RN1.3
$3N30391: length 5
  Top Layer w0.203: 13.54,32.94 12.79,32.94 12.65,33.09 12.65,34.94 12.03,35.56 10.71,35.56
$3N30392: length 3.2
  Top Layer w0.203: 13.54,32.14 13.52,32.13 12.79,32.13 11.9,33.02 DIPZ2.8
$3N30471: length 3.2
  Top Layer w0.203: RN2.3 12.79,31.34 11.92,30.47 DIPZ2.9
$3N30472: length 4.9
  Top Layer w0.203: DIPZ2.10 11.88,27.94 12.65,28.7 12.65,30.4 12.79,30.55 RN2.4
$3N30551: length 3.3
  Top Layer w0.203: RN1.1 13.24,24.31 12.15,25.39 DIPZ2.11
$3N30552: length 3.1
  Top Layer w0.203: DIPZ2.12 12.03,22.86 12.68,23.51 RN1.2

## Copper pours and planes (outline as drawn; the poured copper is in the pictures)
3V3 on Top Layer: 36.21,72.99 36.21,68.3 35.03,68.3 35.03,72.99
+5V on Top Layer: 42,80.89 42,77.59 21.17,77.59 21.17,80.89
+5V on Top Layer: 63.69,75.45 63.69,74.16 40.09,74.16 40.09,75.45
+5V on Top Layer: 42,80.89 42,74.16 40.09,74.16 40.09,80.89
+5V on Top Layer: 22.17,79.4 22.17,72.67 21.07,72.67 21.07,79.4
+5V on Top Layer: 63.31,75.45 68.54,75.45 68.54,73.17 64.3,73.17 63.31,74.16
+5V on Top Layer: 47.08,66.16 47.08,60.42 45.71,60.42 45.71,66.16
+5V on Top Layer: 37.94,80.89 37.94,74.01 35.32,74.01 35.32,80.89
+9V on Top Layer: 69.96,60.86 71.81,60.86 71.81,53 69.96,53
+9V on Top Layer: 92,25.67 82.92,25.67 82.92,12.34 80.48,9.9 64.22,9.9 64.22,4.82 90.73,4.82 92,6.09
+9V on 辅助电源层: 70.17,57.45 71.44,57.45 71.44,4.8 70.17,4.8
+9V on 辅助电源层: 92,25.67 82.92,25.67 82.92,12.34 80.48,9.9 64.22,9.9 64.22,4.82 90.73,4.82 92,6.09
GND on Top Layer: 106.77,85.85 106.77,-6.48 -7.53,-6.48 -7.53,85.85
GND on Bottom Layer: 106.77,85.85 106.77,-6.48 -7.53,-6.48 -7.53,85.85
GND on 主GND层: 106.77,85.85 106.77,-6.48 -7.53,-6.48 -7.53,85.85
GND on 辅助电源层: 106.77,85.85 106.77,-6.48 -7.53,-6.48 -7.53,85.85
VIN on Top Layer: 85.69,73.02 92,73.02 92,49.27 85.69,49.27
VIN on Top Layer: 74.26,50.03 74.26,47.77 70.01,47.77 70.01,50.03
VIN on 辅助电源层: 85.69,73.02 85.69,65.53 86.83,64.38 86.83,49.27 92,49.27 92,63.15 91.4,63.75 91.4,73.02
IMU_3V3 on Top Layer: 46.7,59.62 46.7,52.89 45.45,52.89 45.45,59.62
STC_3V3 on Top Layer: 21.81,71.62 21.81,66.65 20.74,66.65 20.74,71.62
SW1 on Top Layer: 99.4,53.08 99.4,38.86 88.1,38.86 88.1,53.08
SW2 on Top Layer: 99.4,36.06 99.4,20.57 88.1,20.57 88.1,36.06
VCAP on Top Layer: 93.22,80.39 93.22,73.87 74.89,73.87 74.89,80.39
VCAP on Bottom Layer: 93.22,80.39 93.22,73.87 74.89,73.87 74.89,80.39
VCAP on 主GND层: 93.22,80.39 93.22,73.87 74.89,73.87 74.89,80.39
VCAP on 辅助电源层: 93.22,80.39 93.22,73.87 74.89,73.87 74.89,80.39
$1N30337 on Top Layer: 87.81,48.92 87.81,27.53 84.65,27.53 84.65,48.92
$1N30337 on Bottom Layer: 87.81,48.92 87.81,27.53 84.65,27.53 84.65,48.92
$1N30337 on 主GND层: 87.81,48.92 87.81,27.53 84.65,27.53 84.65,48.92
$1N58582 on Top Layer: 68.16,74.92 71.21,74.92 71.21,65.8 68.16,65.8
$1N58737 on Top Layer: 69.81,62.35 70.7,62.35 70.7,63.24 71.34,63.88 71.34,65.36 66.34,65.36 66.34,63.75 69.3,63.75 69.81,63.24

Small or netless copper shapes (teardrops, artwork), in the pictures only: 403 on Top Layer, 28 on Bottom Layer, 20 on 主GND层, 42 on 辅助电源层

## Text on the board
Document Layer: 车头
Top Layer: 华东理工大学 / 起源-20th / 2025.5.10
Top Silkscreen Layer: 左M | OFF | ON | 电机 | 输入 | 串口电源 | 接入 | 断开 | GND | P0.6 P0.5 P0.4 | 电源RST | 左电感 | 中电感 | 右电感 | 右电机 | IMU电源 | 3V3 | 9V电源 | 输入电源 | TX1 | RX1 | +5V | 起跑检测 | 电磁 / 检测 / 5V / 电源
